# EAGLE design alexawrover (EAGLE 9.2.2)
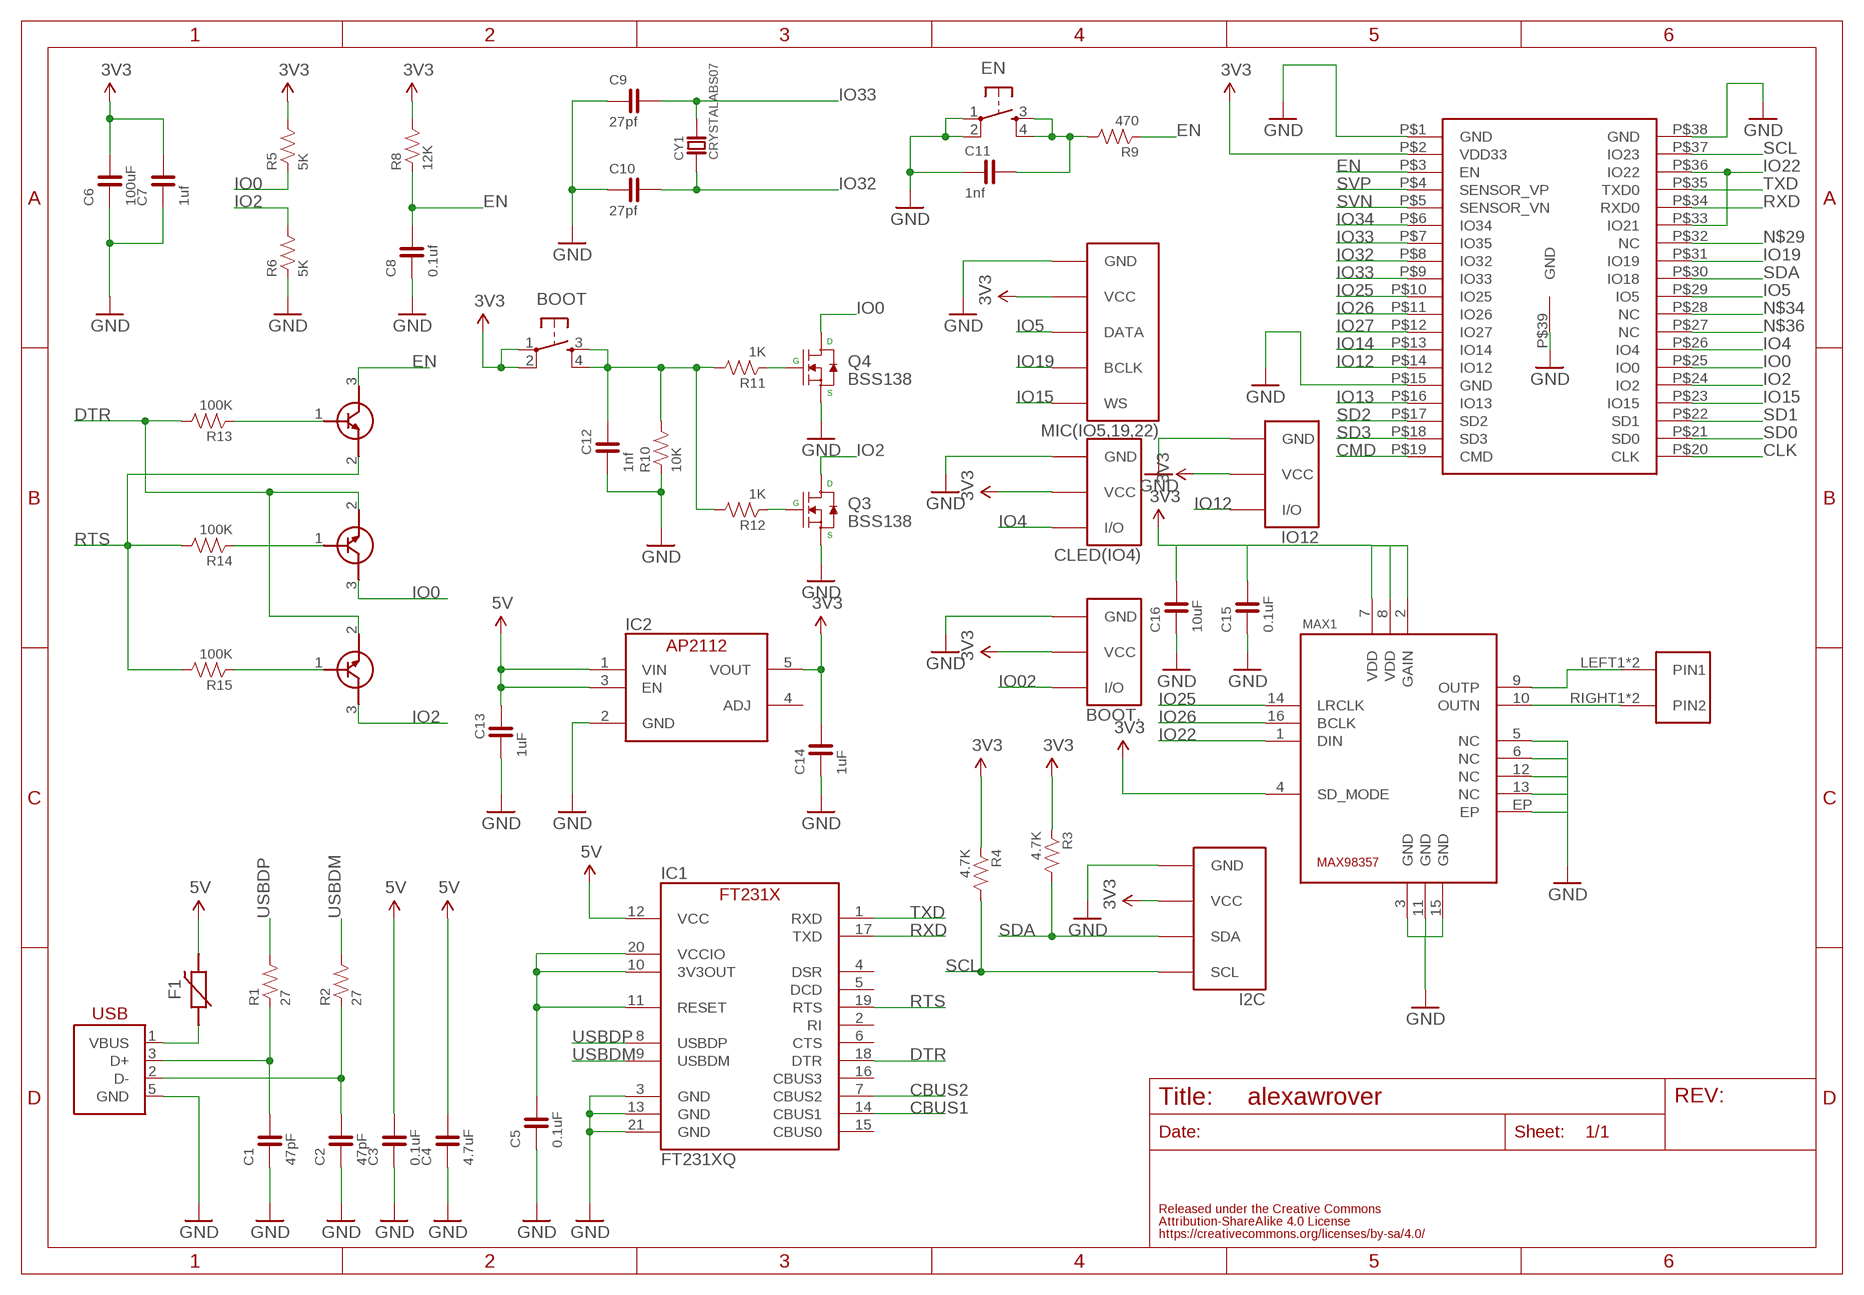
[diagram p0: schematic, sheet 1]

## Parts
BOOT  TACT-SWITCH-SMD_KMR2  [KMR2]
BOOT.  BUTTON  FABO_BRICK_3PIN-03B-PASK-1_NAME_BOTTOM  [FABO_BRICK_3PIN_B03B-PASK-1_NAME_BOTTOM]
C1  47pF  CAPACITOR-0603_NARROW  [0603-NARROW]
C2  47pF  CAPACITOR-0603_NARROW  [0603-NARROW]
C3  0.1uF  CAPACITOR-0603_NARROW  [0603-NARROW]
C4  4.7uF  CAPACITOR-0603_NARROW  [0603-NARROW]
C5  0.1uF  CAPACITOR-0603_NARROW  [0603-NARROW]
C6  100uF  CAPACITOR-1206  [1206]
C7  1uf  CAPACITOR-0603_NARROW  [0603-NARROW]
C8  0.1uf  CAPACITOR-0603_NARROW  [0603-NARROW]
C9  27pf  CAPACITOR-0603_NARROW  [0603-NARROW]
C10  27pf  CAPACITOR-0603_NARROW  [0603-NARROW]
C11  1nf  CAPACITOR-0603_NARROW  [0603-NARROW]
C12  1nf  CAPACITOR-0603_NARROW  [0603-NARROW]
C13  1uF  CAPACITOR-0603  [0603]
C14  1uF  CAPACITOR-0603  [0603]
C15  0.1uF  CAPACITOR-0603  [0603]
C16  10uF  CAPACITOR-0603  [0603]
CLED(IO4)  FABO_BRICK_3PIN-03B-PASK-1_NAME_BOTTOM  [FABO_BRICK_3PIN_B03B-PASK-1_NAME_BOTTOM]
CY1  CRYSTALABS07  [ABRACOM-ABS07-32.768KHZ]
EN  TACT-SWITCH-SMD_KMR2  [KMR2]
F1  POLYSWITCH  [NANOSMDC035F]
I2C  FABO_BRICK_I2C-B04B-PASK-1  [FABO_BRICK_I2C_B04B-PASK-1]
IC1  FT231XQ  [QFN-20_FT231X]
IC2  AP2112K-3.3TRG1  [SOT-23-5]
IO12  FABO_BRICK_3PIN-03B-PASK-1_NAME_BOTTOM  [FABO_BRICK_3PIN_B03B-PASK-1_NAME_BOTTOM]
MAX1  MA-MAX98357  [MAXIM-MAX98357]
MIC(IO5,19,22)  FABO_BRICK_I2STOP  [FABO_BRICK_I2S_B05B-PARK-1]
Q3  BSS138  MOSFET-N-BSS138  [SOT23-3]
Q4  BSS138  MOSFET-N-BSS138  [SOT23-3]
R1  27  RESISTOR-0603-NARROW  [0603-NARROW]
R2  27  RESISTOR-0603-NARROW  [0603-NARROW]
R3  4.7K  RESISTOR-0603-NARROW  [0603-NARROW]
R4  4.7K  RESISTOR-0603-NARROW  [0603-NARROW]
R5  5K  RESISTOR-0603-NARROW  [0603-NARROW]
R6  5K  RESISTOR-0603-NARROW  [0603-NARROW]
R8  12K  RESISTOR-0603-NARROW  [0603-NARROW]
R9  470  RESISTOR-0603-NARROW  [0603-NARROW]
R10  10K  RESISTOR-0603-NARROW  [0603-NARROW]
R11  1K  RESISTOR-0603-NARROW  [0603-NARROW]
R12  1K  RESISTOR-0603-NARROW  [0603-NARROW]
R13  100K  RESISTOR-0603-NARROW  [0603-NARROW]
R14  100K  RESISTOR-0603-NARROW  [0603-NARROW]
R15  100K  RESISTOR-0603-NARROW  [0603-NARROW]
T1  TRANSISTORMMBT2222  [SOT-23]
T2  TRANSISTORMMBT2222  [SOT-23]
T3  TRANSISTORMMBT2222  [SOT-23]
U$1  ESP32-WROVER  [ESP32-WROVER]
U$4  ML-1400-S1  [ML-1400-S1]
USB1  USB-MICRO_B_SMT_HIROSE  [ZX62R-B-5P]

## Nets
3V3: BOOT.1 BOOT.2 BOOT..VCC C6.- C7.2 C14.2 C15.2 C16.2 CLED(IO4).VCC I2C.VCC IC2.5(VOUT) IO12.VCC MAX1.2(GAIN) MAX1.4(SD_MODE) MAX1.7(VDD) MAX1.8(VDD) MIC(IO5,19,22).VCC R3.1 R4.1 R5.2 R8.2 U$1.P$2(VDD33)
5V: C3.2 C4.2 C13.2 F1.2 IC1.12(VCC) IC2.1(VIN) IC2.3(EN)
CBUS1: IC1.14(CBUS1)
CBUS2: IC1.7(CBUS2)
CLK: U$1.P$20(CLK)
CMD: U$1.P$19(CMD)
DTR: IC1.18(DTR) R13.2 T2.2(E) T3.2(E)
EN: C8.2 R8.1 R9.1 T1.3(C) U$1.P$3(EN)
GND: BOOT..GND C1.1 C2.1 C3.1 C4.1 C5.1 C6.+ C7.1 C8.1 C9.1 C10.1 C11.1 C12.1 C13.1 C14.1 C15.1 C16.1 CLED(IO4).GND EN.1 EN.2 I2C.GND IC1.3(GND) IC1.13(GND) IC1.21(GND) IC2.2(GND) IO12.GND MAX1.3(GND) MAX1.5(NC) MAX1.6(NC) MAX1.11(GND) MAX1.12(NC) MAX1.13(NC) MAX1.15(GND) MAX1.EP MIC(IO5,19,22).GND Q3.2(S) Q4.2(S) R6.1 R10.1 U$1.P$1(GND) U$1.P$15(GND) U$1.P$38(GND) U$1.P$39(GND) USB1.5(GND)
IO0: Q4.3(D) R5.1 T2.3(C) U$1.P$25(IO0)
IO2: Q3.3(D) R6.2 T3.3(C) U$1.P$24(IO2)
IO02: BOOT..I/O
IO4: CLED(IO4).I/O U$1.P$26(IO4)
IO5: MIC(IO5,19,22).DATA U$1.P$29(IO5)
IO12: IO12.I/O U$1.P$14(IO12)
IO13: U$1.P$16(IO13)
IO14: U$1.P$13(IO14)
IO15: MIC(IO5,19,22).WS U$1.P$23(IO15)
IO19: MIC(IO5,19,22).BCLK U$1.P$31(IO19)
IO22: MAX1.1(DIN) U$1.P$33(IO21) U$1.P$36(IO22)
IO25: MAX1.14(LRCLK) U$1.P$10(IO25)
IO26: MAX1.16(BCLK) U$1.P$11(IO26)
IO27: U$1.P$12(IO27)
IO32: C10.2 CY1.P$1 U$1.P$8(IO32)
IO33: C9.2 CY1.P$2 U$1.P$7(IO35) U$1.P$9(IO33)
IO34: U$1.P$6(IO34)
N$1: R13.1 T1.1(B)
N$2: R14.1 T2.1(B)
N$3: C2.2 R2.1 USB1.2(D-)
N$4: C1.2 R1.1 USB1.3(D+)
N$5: C11.2 EN.3 EN.4 R9.2
N$6: BOOT.3 BOOT.4 C12.2 R10.2 R11.2 R12.2
N$7: C5.2 IC1.10(3V3OUT) IC1.11(RESET) IC1.20(VCCIO)
N$8: R15.1 T3.1(B)
N$9: MAX1.10(OUTN) U$4.RIGHT1(PIN2) U$4.RIGHT2(PIN2)
N$10: MAX1.9(OUTP) U$4.LEFT1(PIN1) U$4.LEFT2(PIN1)
N$11: Q4.1(G) R11.1
N$12: Q3.1(G) R12.1
N$29: U$1.P$32(NC)
N$34: U$1.P$28(NC)
N$36: U$1.P$27(NC)
RTS: IC1.19(RTS) R14.2 R15.2 T1.2(E)
RXD: IC1.17(TXD) U$1.P$34(RXD0)
SCL: I2C.SCL R4.2 U$1.P$37(IO23)
SD0: U$1.P$21(SD0)
SD1: U$1.P$22(SD1)
SD2: U$1.P$17(SD2)
SD3: U$1.P$18(SD3)
SDA: I2C.SDA R3.2 U$1.P$30(IO18)
SVN: U$1.P$5(SENSOR_VN)
SVP: U$1.P$4(SENSOR_VP)
TXD: IC1.1(RXD) U$1.P$35(TXD0)
USBDM: IC1.9(USBDM) R2.2
USBDP: IC1.8(USBDP) R1.2
VBUS: F1.1 USB1.1(VBUS)
Unconnected: IC1.2(RI) IC1.4(DSR) IC1.5(DCD) IC1.6(CTS) IC1.15(CBUS0) IC1.16(CBUS3) IC2.4(ADJ)

## Library data of the parts
BOOT EN = FaBo-Switch:TACT-SWITCH
BOOT. CLED(IO4) IO12 = FaBo-Template:FABO_BRICK_3PIN: FaBo Brick 3pin
C1-C16 = FaBo-Capacitor:CAPACITOR: CAPACITOR
CY1 = FaBo-Crystal:CRYSTAL
F1 = FaBo-Parts:POLYSWITCH
I2C = FaBo-Template:FABO_BRICK_I2C: FaBo Brick I2C
IC1 = FaBo-USB:FT231X
IC2 = FaBo-Supply:AP2112
MAX1 = FaBo-Mems:MA-MAX98357
MIC(IO5,19,22) = FaBo-Template:FABO_BRICK_I2S
Q3 Q4 = FaBo-etc:MOSFET-N
R1-R6 R8-R15 = FaBo-Resistors:RESISTOR: RESISTOR
T1-T3 = FaBo-Transistor:TRANSISTOR
U$1 = FaBo-ESP32:ESP32-WROVER
U$4 = FaBo-Terminal:ML-1400-S1
USB1 = FaBo-USB:USB

## Board
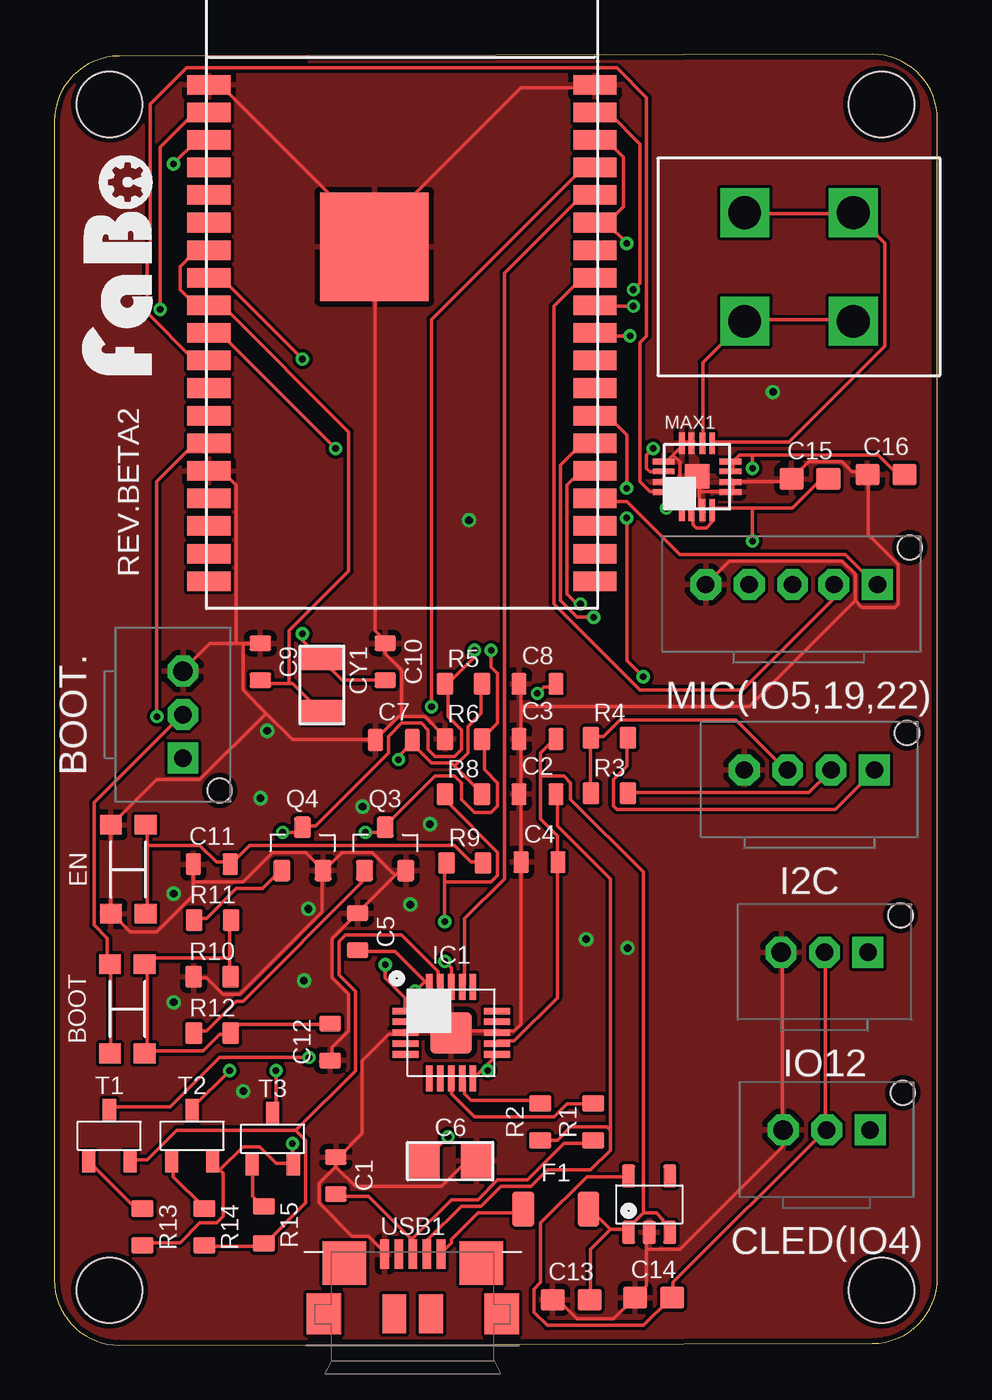
[diagram p1: board, top side]
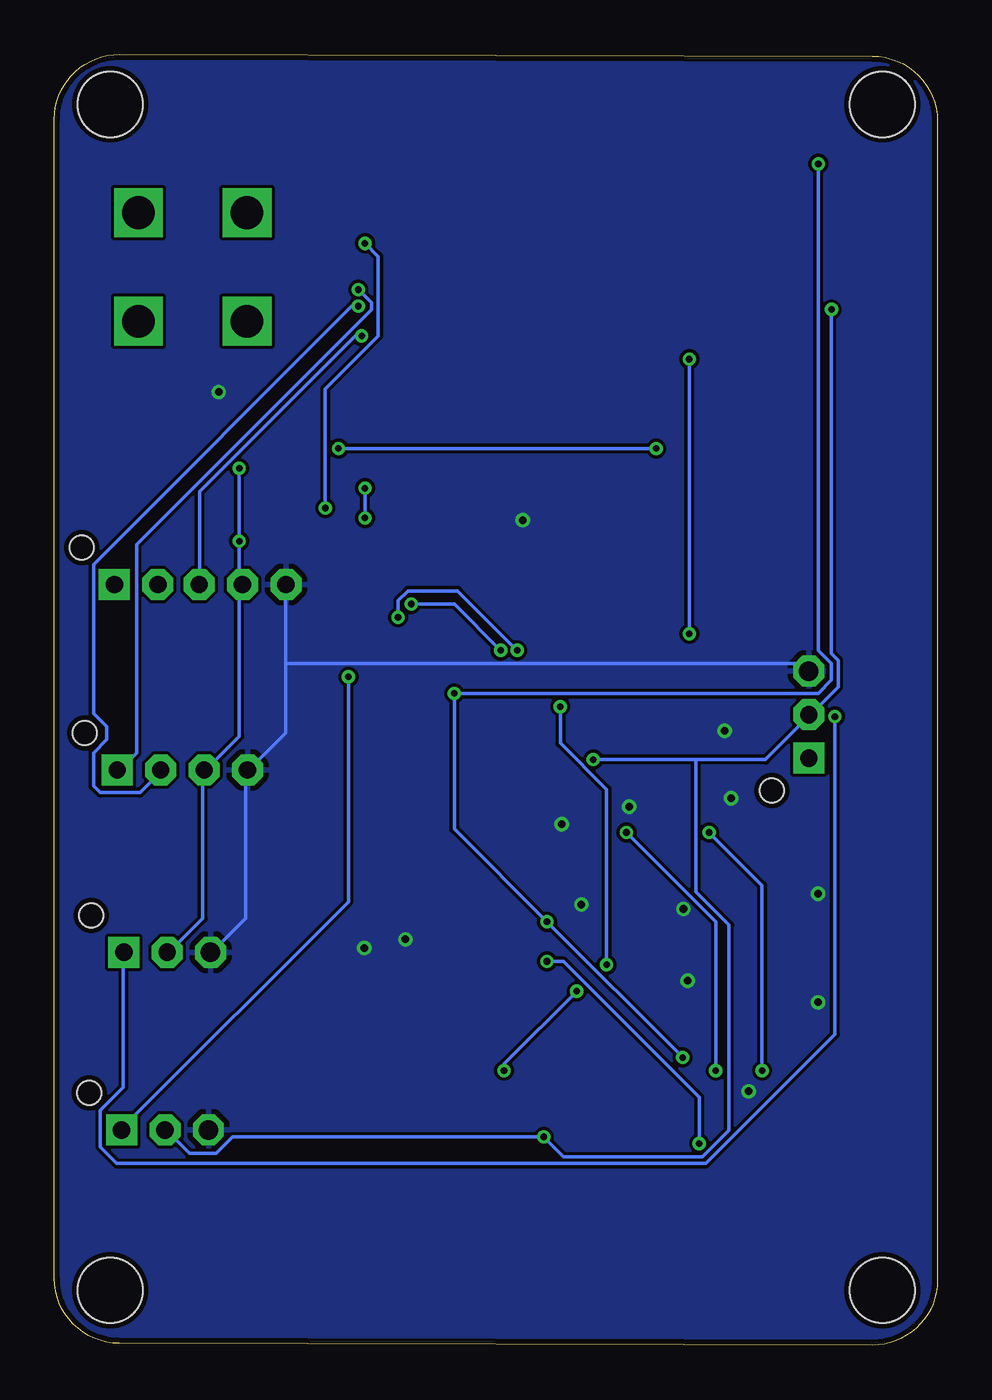
[diagram p2: board, bottom side, seen from below]

Size 40.67 x 59.45 mm. Coordinates in mm from the lower left corner, seen from the top.
Outline: 0,56.36 0,3 arc90 3.01,0 37.68,0.09 arc90 40.67,3.09 40.67,56.45 arc90 37.67,59.45 2.99,59.36 arc90 0,56.36
Copper layers (1*16): Top 0.035mm / dielectric 1.5mm / Bottom 0.035mm
Design rules "SeeedStudio_2layer_DRU_no_angle_20140221": minimum track width 6mil, minimum drill 12mil, track to track 6mil, track to pad 6mil, pad to pad 6mil, via to via 6mil, smd to smd 0mil, copper to edge 10mil, drill to drill 10mil, minimum pad ring 10mil, minimum via ring 6mil, stop-mask expansion 2mil, vias tented up to drill 100mil, thermal gap 10mil
Holes 3 mm at 2.54,57.14 2.54,2.53 38.1,2.53 38.1,57.14

### Footprints (pad centres in the part's own frame; a part is rotated, then mirrored left to right if it is on the bottom)
KMR2 = smd 0.9 x 1: 1 -2.05,0.8; 2 2.05,0.8; 3 2.05,-0.8; 4 -2.05,-0.8
FABO_BRICK_3PIN_B03B-PASK-1_NAME_BOTTOM = drill 0.9 pad 1.422 octagon: GND -2,0 | drill 0.8 pad 1.422 square: I/O 2,0 | drill 0.8 pad 1.422 octagon: VCC 0,0 | hole 1.1: 3.5,1.7
0603-NARROW = smd 0.71 x 1: 1 -0.85,0; 2 0.85,0
1206 = smd 1.4 x 1.6: + 1.2,0; - -1.2,0
0603 = smd 1.1 x 1: 1 -0.85,0; 2 0.85,0
ABRACOM-ABS07-32.768KHZ = smd 1.1 x 1.9: P$1 -1.25,0; P$2 1.25,0
NANOSMDC035F = smd 1 x 1.6: 1 -1.5,0; 2 1.5,0
FABO_BRICK_I2C_B04B-PASK-1 = drill 0.8 pad 1.422 octagon: GND -3,0; SDA 1,0; VCC -1,0 | drill 0.8 pad 1.422 square: SCL 3,0 | hole 1.1: 4.5,1.7
QFN-20_FT231X = smd 1.2 x 0.3: 1 -2.1,1; 2 -2.1,0.5; 3 -2.1,0; 4 -2.1,-0.5; 5 -2.1,-1; 11 2.1,-1; 12 2.1,-0.5; 13 2.1,0; 14 2.1,0.5; 15 2.1,1 | smd 0.3 x 1.2: 6 -1,-2.1; 7 -0.5,-2.1; 8 0,-2.1; 9 0.5,-2.1; 10 1,-2.1; 16 1,2.1; 17 0.5,2.1; 18 0,2.1; 19 -0.5,2.1; 20 -1,2.1 | smd 1.9 x 1.9: 21 0,0
SOT-23-5 = smd 0.6 x 1.05: 1 -0.95,-1.3; 2 0,-1.3; 3 0.95,-1.3; 4 0.95,1.3; 5 -0.95,1.3
MAXIM-MAX98357 = smd 0.27 x 1: 1 -0.7,-1.54; 2 -0.25,-1.54; 3 0.25,-1.54; 4 0.7,-1.54; 9 0.7,1.54; 10 0.25,1.54; 11 -0.25,1.54; 12 -0.7,1.54 | smd 1 x 0.27: 5 1.54,-0.7; 6 1.54,-0.25; 7 1.54,0.25; 8 1.54,0.7; 13 -1.54,0.7; 14 -1.54,0.25; 15 -1.54,-0.25; 16 -1.54,-0.7 | smd 1.143 x 1.143: EP 0.005,0.02
FABO_BRICK_I2S_B05B-PARK-1 = drill 0.8 pad 1.422 octagon: BCLK 1.635,2.54; DATA -0.27,2.54; GND -4.27,2.54; VCC -2.27,2.54 | drill 0.8 pad 1.422 square: WS 3.635,2.54 | hole 1.1: 5.135,4.24
SOT23-3 = smd 0.8 x 1: 1 -0.95,-1; 2 0.95,-1; 3 0,1
0603-NARROW' = smd 0.75 x 1: 1 -0.85,0; 2 0.85,0
SOT-23 = smd 0.6 x 1: 1 -0.95,-1.2; 2 0.95,-1.2; 3 0,1.2
ESP32-WROVER = smd 2 x 0.9: P$1 -8.89,8.89; P$2 -8.89,7.62; P$3 -8.89,6.35; P$4 -8.89,5.08; P$5 -8.89,3.81; P$6 -8.89,2.54; P$7 -8.89,1.27; P$8 -8.89,0; P$9 -8.89,-1.27; P$10 -8.89,-2.54; P$11 -8.89,-3.81; P$12 -8.89,-5.08; P$13 -8.89,-6.35; P$14 -8.89,-7.62; P$15 -8.89,-8.89; P$16 -8.89,-10.16; P$17 -8.89,-11.43; P$18 -8.89,-12.7; P$19 -8.89,-13.97; P$20 8.89,-13.97; P$21 8.89,-12.7; P$22 8.89,-11.43; P$23 8.89,-10.16; P$24 8.89,-8.89; P$25 8.89,-7.62; P$26 8.89,-6.35; P$27 8.89,-5.08; P$28 8.89,-3.81; P$29 8.89,-2.54; P$30 8.89,-1.27; P$31 8.89,0; P$32 8.89,1.27; P$33 8.89,2.54; P$34 8.89,3.81; P$35 8.89,5.08; P$36 8.89,6.35; P$37 8.89,7.62; P$38 8.89,8.89 | smd 5 x 5: P$39 -1.27,1.43
ML-1400-S1 = drill 1.5 square: LEFT1 -2.5,2.5; LEFT2 -2.5,-2.5; RIGHT1 2.5,2.5; RIGHT2 2.5,-2.5
ZX62R-B-5P = smd 0.4 x 1.35: 1 1.3,4.2; 2 0.65,4.2; 3 0,4.2; 4 -0.65,4.2; 5 -1.3,4.2 | smd 2 x 2: 6 3.15,3.8; 7 -3.15,3.8 | smd 1.6 x 1.9: 8 4.1,1.45; 11 -4.1,1.45 | smd 1.1 x 1.8: 9 0.85,1.45; 10 -0.85,1.45

### Placement (x,y rotation side)
BOOT  3.37,15.49 90 top
BOOT.  5.92,29.04 270 top
C1  12.97,7.81 270 top
C2  22.25,25.37 0 top
C3  22.25,27.91 0 top
C4  22.35,22.24 0 top
C5  13.97,19.04 270 top
C6  18.24,8.48 0 top
C7  15.64,27.87 0 top
C8  22.25,30.45 0 top
C9  9.49,31.47 270 top
C10  15.24,31.47 270 top
C11  7.25,22.15 0 top
C12  12.7,13.96 90 top
C13  23.8,2.09 0 top
C14  27.6,2.19 0 top
C15  34.8,39.89 0 top
C16  38.3,40.09 0 top
CLED(IO4)  35.58,9.91 0 top
CY1  12.33,30.4 270 top
EN  3.4,21.91 90 top
F1  23.1,6.27 0 top
I2C  34.77,26.49 0 top
IC1  18.28,14.39 0 top
IC2  27.4,6.49 0 top
IO12  35.48,18.09 0 top
MAX1  29.6,39.99 0 top
MIC(IO5,19,22)  34.27,32.49 0 top
Q3  15.24,22.85 0 top
Q4  11.43,22.85 0 top
R1  27  [0603-NARROW']  24.82,10.28 90 top
R2  27  [0603-NARROW']  22.38,10.28 90 top
R3  4.7K  [0603-NARROW']  25.57,25.42 0 top
R4  4.7K  [0603-NARROW']  25.57,27.97 0 top
R5  5K  [0603-NARROW']  18.84,30.45 0 top
R6  5K  [0603-NARROW']  18.84,27.91 0 top
R8  12K  [0603-NARROW']  18.84,25.37 0 top
R9  470  [0603-NARROW']  18.91,22.21 0 top
R10  10K  [0603-NARROW']  7.27,16.97 0 top
R11  1K  [0603-NARROW']  7.29,19.58 0 top
R12  1K  [0603-NARROW']  7.28,14.37 0 top
R13  100K  [0603-NARROW']  4.07,5.44 270 top
R14  100K  [0603-NARROW']  6.91,5.44 270 top
R15  100K  [0603-NARROW']  9.65,5.54 270 top
T1  2.54,9.65 0 top
T2  6.35,9.65 0 top
T3  10.06,9.51 0 top
U$1  16.01,49.15 0 top
U$4  34.3,49.65 270 top
U$5  [LOGO_FABO_MS]  4.9,49.74 90 top
USB1  16.51,-0.01 0 top

### Tracks (layer width: path | path; a pad name or v marks a point on that pad's centre or on a via)
3V3  (via drill 0.3)
  Top 0.152: 18.44,26.66 18.29,26.81 17.37,26.81 16.46,27.73 | 18.44,26.66 19.66,25.44 R8.2 | 18.44,26.66 19.05,27.27 19.05,28.49 19.66,29.1 19.66,30.32 R5.2 | BOOT.1 2.59,13.56 2.59,17.52 BOOT.2 2.44,17.67 2.44,18.74 1.83,19.35 1.83,24.99 5.79,28.95 BOOT..VCC | v4.88,47.69 4.88,55.16 6.4,56.69 7.01,56.69 U$1.P$2 | 16.46,27.73 15.85,27.12 v15.85,26.97 | 16.46,27.73 C7.2 | 31.24,40.68 31.24,40.23 MAX1.7 | 32.16,40.99 31.55,40.99 31.24,40.68 | 32.16,40.99 37.95,40.99 38.71,40.23 39.01,40.23 C16.2 | 31.24,40.68 MAX1.8 | MAX1.2 29.41,38.4 29.41,37.79 29.57,37.64 30.02,37.64 30.33,37.94 30.33,38.4 MAX1.4 30.33,38.55 32.16,38.55 | 32.16,38.55 33.98,38.55 35.2,39.77 35.51,39.77 C15.2 | R3.1 24.69,25.44 24.69,27.88 R4.1 24.84,28.03 25.3,28.03 26.06,28.8 31.39,28.8 33.68,26.51 I2C.VCC | v32.16,37.03 32.16,38.55 | v32.16,40.38 32.16,40.99 | IC2.5 26.36,7.76 24.54,7.76 22.4,5.63 22.4,2.89 22.1,2.58 22.1,1.52 22.71,0.91 27.13,0.91 28.35,2.13 C14.2 28.5,2.28 28.5,2.89 35.51,9.9 CLED(IO4).VCC 35.51,10.05 35.51,17.98 IO12.VCC | v18.14,9.59 17.07,8.53 C6.-
  Bottom 0.152: v4.88,47.69 4.88,31.84 4.57,31.54 4.57,30.32 5.79,29.1 BOOT..VCC 5.94,28.95 7.92,26.97 11.12,26.97 | 11.12,26.97 v15.85,26.97 | v32.16,40.38 v32.16,37.03 32.16,35.04 MIC(IO5,19,22).VCC 32.16,34.89 32.16,28.03 33.68,26.51 I2C.VCC 33.83,26.36 33.83,19.65 35.36,18.13 IO12.VCC | CLED(IO4).VCC 35.51,9.9 34.44,8.83 33.22,8.83 32.46,9.59 v18.14,9.59 17.22,8.68 10.82,8.68 9.6,9.9 9.6,19.35 11.12,20.87 11.12,26.97
5V
  Top 0.152: 25.6,5.33 26.36,5.33 | 25.6,5.33 24.69,6.24 F1.2 | 27.13,6.09 27.74,6.09 28.04,5.78 28.04,5.63 28.35,5.33 IC2.3 | 26.36,5.33 27.13,6.09 | 26.36,5.33 IC2.1 | 25.6,5.33 24.69,4.41 24.69,2.13 C13.2 | 22.4,26.21 22.4,27.27 23.01,27.88 C3.2 | 22.4,26.21 22.4,24.22 23.16,23.46 23.16,22.24 C4.2 23.16,22.09 23.16,15.99 21.18,14.01 20.42,14.01 IC1.12 | 27.13,6.09 27.13,21.79 23.77,25.14 23.77,25.9 23.47,26.21 22.4,26.21
DTR  (via drill 0.3)
  Top 0.152: 7.62,8.07 7.32,8.37 T2.2 | 7.62,8.07 7.77,7.92 7.77,5.94 7.47,5.63 6.71,5.63 5.79,4.72 4.12,4.72 R13.2 | 10.97,8.37 10.21,8.37 9.45,9.14 8.69,9.14 7.62,8.07 | v17.98,17.67 18.29,17.37 18.29,16.6 IC1.18 | 10.97,8.37 v10.97,9.29 | 10.97,8.37 T3.2
  Bottom 0.152: v17.98,17.67 17.22,17.67 10.97,11.42 v10.97,9.29
EN  (via drill 0.3)
  Top 0.152: v11.73,13.25 7.62,13.25 5.33,10.97 2.59,10.97 T1.3 | 17.98,21.33 17.98,22.09 R9.1 | 17.98,21.33 v17.98,19.5 | 17.98,21.33 20.12,21.33 20.42,21.63 20.42,22.7 18.14,24.99 18.14,25.29 R8.1 | v22.25,30.02 22.55,30.32 23.01,30.32 C8.2 | v5.49,54.4 6.55,55.47 7.01,55.47 U$1.P$3
  Bottom 0.152: v11.73,13.25 v17.98,19.5 22.25,23.77 v22.25,30.02 5.49,30.02 4.88,30.62 4.88,31.39 5.49,32 v5.49,54.4
GND  (via drill 0.35)
  Top 0.152: 21.49,29.41 21.49,28.03 C3.1 21.49,27.88 21.49,25.44 C2.1 21.49,25.29 21.49,22.24 C4.1 21.49,22.09 21.49,14.78 21.18,14.47 20.42,14.47 IC1.13 20.27,14.47 18.29,14.47 IC1.21 18.14,14.47 16.31,14.47 IC1.3 16.15,14.32 15.39,14.32 14.17,13.1 14.17,9.75 13.11,8.68 C1.1 12.95,8.53 12.95,8.22 | 21.49,29.41 21.49,30.32 C8.1 | 12.95,8.22 12.19,7.46 12.19,6.55 13.72,5.02 14.48,5.02 15.24,4.26 USB1.5 | 12.95,8.22 13.87,7.31 17.83,7.31 18.9,8.37 19.36,8.37 C6.+ | 28.5,40.99 28.96,41.45 MAX1.12 28.96,41.6 29.26,41.6 MAX1.11 | 28.5,40.99 28.19,40.68 MAX1.13 | 29.72,39.77 29.72,39.92 MAX1.EP 29.72,39.77 | 29.72,39.77 29.72,39.31 | 29.72,39.31 29.72,38.55 MAX1.3 | 29.72,39.77 28.8,39.77 | 28.8,39.77 28.19,39.77 MAX1.15 | 28.5,40.99 28.8,40.68 28.8,39.77 | 29.72,39.31 31.09,39.31 MAX1.5 31.24,39.31 31.24,39.62 MAX1.6 31.24,39.77 33.83,39.77 C15.1 33.98,39.92 34.75,40.68 36.27,40.68 36.73,40.23 37.34,40.23 C16.1 37.49,40.07 37.49,37.33 38.86,35.96 38.86,34.13 38.71,33.98 37.19,33.98 36.88,34.28 | 27.28,4.41 27.28,2.74 26.82,2.28 C14.1 26.67,2.13 25.76,1.21 24.08,1.21 23.32,1.97 23.01,1.97 C13.1 | 27.28,4.41 27.28,5.17 IC2.2 | IO12.GND 33.53,17.98 33.53,10.05 CLED(IO4).GND 33.53,9.9 33.53,9.14 28.8,4.41 27.28,4.41 | 36.88,34.28 36.88,35.5 36.27,36.11 31.09,36.11 30.02,35.04 MIC(IO5,19,22).GND | 21.49,29.41 32,29.41 36.88,34.28 | 14.63,51.05 7.77,57.9 7.16,57.9 U$1.P$1 | 14.63,51.05 14.63,50.59 U$1.P$39 | 14.63,51.05 21.49,57.9 24.84,57.9 U$1.P$38 | 14.63,51.05 U$1.P$39 | C12.1 12.8,13.25 12.8,13.71 13.56,14.47 13.56,16.15 12.8,16.91 12.8,18.74 13.87,19.8 C5.1 14.02,19.96 15.7,21.63
  Top 0.152: 15.7,21.63 15.85,21.79 16.15,21.79 Q3.2 | 6.4,21.33 6.4,20.72 4.72,19.04 3.5,19.04 2.74,19.8 EN.1 2.59,19.96 2.59,23.92 EN.2 2.74,24.07 4.72,26.05 6.71,26.05 9.75,29.1 | 6.4,21.33 6.4,22.09 C11.1 | R10.1 6.55,16.91 7.01,16.91 7.77,16.15 8.53,16.15 12.34,19.96 12.34,21.79 Q4.2 | 6.4,21.33 8.69,21.33 10.06,22.7 11.58,22.7 12.34,21.94 Q4.2 | 15.7,21.63 14.63,22.7 13.26,22.7 12.5,21.94 Q4.2 | 16,28.95 17.07,28.95 17.98,28.03 R6.1 | 16,28.95 15.85,28.95 14.94,28.03 14.94,27.88 C7.1 10.97,27.88 9.75,29.1 | 16,28.95 16,31.08 15.24,31.84 C10.1 15.24,32.45 14.78,32.91 14.78,50.44 U$1.P$39 | 8.38,32.3 7.16,32.3 5.94,31.08 BOOT..GND | 8.38,32.3 8.69,32.3 | 8.69,32.3 9.45,32.3 C9.1 | 8.38,32.3 8.38,39.62 7.77,40.23 7.16,40.23 U$1.P$15 | 9.75,29.1 8.69,30.17 8.69,32.3
  Bottom 0.152: IO12.GND 33.38,18.13 31.85,19.65 31.85,26.36 I2C.GND 31.7,26.51 30.02,28.19 30.02,31.39 | 30.02,31.39 30.02,34.89 MIC(IO5,19,22).GND | 30.02,31.39 6.25,31.39 5.94,31.08 BOOT..GND
  other vias: 9.8,28.29 9.5,25.19 17.3,23.99 14.2,24.79 11.7,20.09 11.5,16.79 8.7,11.69 24.5,18.69 26.4,18.29 19.1,37.99 33.1,43.89 16.4,20.29 5.5,15.79 5.5,20.79
  pour Top: 0,-0.01 40.64,-0.01 40.64,59.68 0,59.68
  pour Bottom: 0,-0.01 40.64,-0.01 40.64,59.68 0,59.68
IO0  (via drill 0.3)
  Top 0.152: v8.08,12.64 6.4,10.97 T2.3 | v10.52,23.61 11.28,23.61 11.43,23.77 Q4.3 11.43,23.92 12.04,23.92 15.39,27.27 15.39,28.03 16,28.64 16.92,28.64 17.22,28.34 17.22,27.42 17.53,27.12 18.44,27.12 18.75,27.42 18.75,28.34 18.14,28.95 18.14,30.32 R5.1 18.14,30.47 19.36,31.69 v19.36,32 | v24.84,33.52 24.08,33.52 23.32,34.28 23.32,40.53 24.23,41.45 24.84,41.45 U$1.P$25
  Bottom 0.152: v8.08,12.64 8.08,21.18 v10.52,23.61 | v24.84,33.52 24.84,34.28 24.38,34.74 22.1,34.74 v19.36,32
IO2  (via drill 0.3)
  Top 0.152: v10.21,12.64 10.21,10.81 T3.3 | v14.33,23.61 15.09,23.61 15.24,23.77 Q3.3 15.24,23.92 17.53,26.21 18.44,26.21 18.75,25.9 18.75,25.14 19.36,24.53 20.12,24.53 20.42,24.83 20.42,25.9 19.81,26.51 19.81,27.88 R6.2 19.81,28.03 20.42,28.64 20.42,30.93 20.12,31.23 v20.12,32 | v24.23,34.13 24.08,34.13 23.62,34.59 23.62,39.62 24.23,40.23 24.84,40.23 U$1.P$24
  Bottom 0.152: v10.21,12.64 10.21,19.5 v14.33,23.61 | v24.23,34.13 22.25,34.13 v20.12,32
IO4  (via drill 0.3)
  Top 0.152: v26.36,39.46 26.36,41.9 25.6,42.66 24.99,42.66 U$1.P$26 | v26.36,38.09 26.36,31.54 v27.13,30.78
  Bottom 0.152: v26.36,38.09 v26.36,39.46 | v27.13,30.78 27.13,20.41 37.49,10.05 CLED(IO4).I/O
IO5  (via drill 0.3)
  Top 0.152: v26.52,46.47 24.99,46.47 U$1.P$29
  Bottom 0.152: v26.52,46.47 26.82,46.47 33.98,39.31 33.98,35.04 MIC(IO5,19,22).DATA
IO12  (via drill 0.3)
  Top 0.152: v4.72,28.95 4.72,39.77 6.4,41.45 7.01,41.45 U$1.P$14
  Bottom 0.152: v4.72,28.95 4.72,14.32 10.67,8.37 37.8,8.37 38.56,9.14 38.56,10.81 37.49,11.88 37.49,17.98 IO12.I/O
IO15
  Top 0.152: U$1.P$23 24.99,38.85 26.36,38.85 28.8,36.42 36.42,36.42 37.8,35.04 MIC(IO5,19,22).WS
IO19
  Top 0.152: U$1.P$31 24.84,49.07 24.23,49.07 23.01,47.85 23.01,34.13 26.98,30.17 31.7,30.17 35.81,34.28 35.81,34.89 MIC(IO5,19,22).BCLK
IO22  (via drill 0.3)
  Top 0.152: v28.19,38.55 28.8,38.55 MAX1.1 | 25.45,51.66 v26.36,50.74 | 25.45,51.66 24.99,51.66 U$1.P$33 25.45,51.66 | 25.45,51.66 26.21,52.42 26.21,54.7 25.45,55.47 24.99,55.47 U$1.P$36
  Bottom 0.152: v28.19,38.55 28.19,44.04 25.76,46.47 25.76,50.13 v26.36,50.74
IO25  (via drill 0.3)
  Top 0.152: v27.58,41.29 27.28,40.99 27.28,40.38 27.43,40.23 28.04,40.23 MAX1.14 | v12.95,41.29 7.77,46.47 7.16,46.47 U$1.P$10
  Bottom 0.152: v12.95,41.29 v27.58,41.29
IO26
  Top 0.152: MAX1.16 28.04,39.31 27.43,39.31 26.98,39.77 26.98,46.17 27.28,46.47 27.28,57.45 25.91,58.82 6.1,58.82 4.42,57.14 4.42,50.28 4.27,50.13 4.27,47.54 6.4,45.41 7.01,45.41 U$1.P$11
IO32  (via drill 0.3)
  Top 0.152: C10.2 13.26,30.62 12.34,31.54 CY1.P$1 12.19,31.69 11.43,32.45 v11.43,32.76 | v11.43,45.41 7.77,49.07 7.16,49.07 U$1.P$8
  Bottom 0.152: v11.43,32.76 v11.43,45.41
IO33
  Top 0.152: U$1.P$7 7.01,50.28 6.4,50.28 5.79,49.67 5.79,48.61 6.4,48 7.01,48 U$1.P$9 7.16,47.85 7.77,47.85 13.56,42.05 13.56,35.65 10.82,32.91 10.82,30.47 | 10.82,30.47 10.97,30.47 12.19,29.25 CY1.P$2 | 10.82,30.47 9.6,30.47 C9.2
N$1
  Top 0.152: R13.1 3.96,6.39 3.66,6.39 1.68,8.37 T1.1
N$2
  Top 0.152: T2.1 5.49,8.37 5.49,7.76 6.86,6.39 R14.1
N$3
  Top 0.152: 25.6,9.9 25.45,10.05 23.77,10.05 23.16,9.44 22.4,9.44 R2.1 | 25.6,9.9 25.6,8.98 24.69,8.07 22.71,8.07 21.95,7.31 20.57,7.31 19.66,6.39 18.75,6.39 17.22,4.87 17.22,4.26 USB1.2 | 25.6,9.9 25.6,21.48 23.16,23.92 23.16,25.29 C2.2
N$4
  Top 0.152: 16.46,4.87 14.48,6.85 13.11,6.85 C1.2 | 16.46,4.87 16.46,4.26 USB1.3 | 16.46,4.87 18.29,6.7 19.51,6.7 20.42,7.61 21.79,7.61 23.47,9.29 24.69,9.29 R1.1
N$5
  Top 0.152: 4.27,23 4.27,23.92 EN.3 | 4.27,23 4.27,19.96 EN.4 | 4.27,23 6.71,23 7.47,22.24 8.08,22.24 C11.2 8.23,22.24 8.99,23 18.44,23 19.2,22.24 19.66,22.24 R9.2
N$6
  Top 0.152: 8.08,17.82 8.08,19.5 R11.2 | 8.08,17.82 8.08,17.06 R10.2 | 4.27,13.56 4.27,17.52 BOOT.3 4.27,17.67 4.42,17.82 8.08,17.82 | 4.27,13.56 6.86,13.56 7.62,14.32 8.08,14.32 R12.2 8.23,14.47 8.53,14.78 12.65,14.78 C12.2 | 4.27,13.56 BOOT.4
N$7  (via drill 0.3)
  Top 0.152: 19.81,12.79 20.27,13.25 IC1.11 | 19.81,12.79 19.36,12.34 IC1.10 | 17.07,16.76 17.22,16.6 IC1.20 | 17.07,16.76 15.7,18.13 14.02,18.13 C5.2 | v19.96,12.64 19.81,12.79 | 17.07,16.76 v16.61,16.3
  Bottom 0.152: v19.96,12.64 19.96,12.95 v16.61,16.3
N$8
  Top 0.152: T3.1 9.14,8.22 9.14,6.85 9.6,6.39 R15.1
N$9
  Top 0.152: MAX1.10 29.87,41.6 29.87,45.26 31.7,47.08 U$4.RIGHT2 31.85,47.24 36.73,47.24 U$4.RIGHT1
N$10
  Top 0.152: MAX1.9 30.33,41.6 33.83,41.6 38.25,46.02 38.25,50.74 36.88,52.11 U$4.LEFT1 36.73,52.11 31.85,52.11 U$4.LEFT2
N$11
  Top 0.152: R11.1 6.55,19.65 7.01,19.65 8.38,21.02 9.6,21.02 10.36,21.79 Q4.1
N$12
  Top 0.152: R12.1 6.55,14.47 7.01,14.47 8.38,15.84 8.69,15.84 14.17,21.33 14.17,21.79 Q3.1
RTS
  Top 0.152: 11.12,9.9 5.64,9.9 4.27,8.53 3.5,8.53 T1.2 | 11.12,9.9 11.58,9.44 11.58,6.55 9.75,4.72 R15.2 9.6,4.56 7.01,4.56 R14.2 | 11.12,9.9 13.87,12.64 13.87,16.3 13.11,17.06 13.11,18.59 13.41,18.89 16,18.89 17.68,17.21 17.68,16.6 IC1.19
RXD
  Top 0.152: IC1.17 18.9,16.6 18.9,19.65 20.73,21.48 20.73,49.37 24.23,52.88 24.84,52.88 U$1.P$34
SCL  (via drill 0.3)
  Top 0.152: R4.2 26.36,27.88 26.36,26.66 25.76,26.05 25.76,24.83 25.91,24.68 35.97,24.68 37.64,26.36 I2C.SCL | v26.67,48.61 26.98,48.91 26.98,55.31 25.6,56.69 24.99,56.69 U$1.P$37
  Bottom 0.152: v26.67,48.61 26.06,48 26.06,47.69 36.88,36.87 36.88,27.27 37.64,26.51 I2C.SCL
SDA  (via drill 0.3)
  Top 0.152: R3.2 26.52,25.44 34.75,25.44 35.66,26.36 I2C.SDA | v26.67,47.85 24.99,47.85 U$1.P$30
  Bottom 0.152: v26.67,47.85 26.98,47.85 38.86,35.96 38.86,29.1 38.25,28.49 38.25,27.88 38.86,27.27 38.86,25.75 38.56,25.44 36.73,25.44 35.81,26.36 I2C.SDA
TXD  (via drill 0.3)
  Top 0.152: v15.24,17.52 15.24,16.91 16.15,15.99 16.15,15.54 IC1.1 | v17.37,29.41 17.37,47.24 24.23,54.09 24.84,54.09 U$1.P$35
  Bottom 0.152: v15.24,17.52 15.24,25.6 17.37,27.73 v17.37,29.41
USBDM
  Top 0.152: R2.2 22.25,11.27 19.2,11.27 18.9,11.57 18.9,12.18 IC1.9
USBDP
  Top 0.152: R1.2 24.69,11.12 23.62,11.12 23.01,10.51 19.36,10.51 18.29,11.57 18.29,12.18 IC1.8
VBUS
  Top 0.152: USB1.1 17.83,4.26 18.29,4.72 18.29,4.87 19.51,6.09 21.34,6.09 21.49,6.24 F1.1

### Text on the board
tPlace: REV.BETA2